# EAGLE board FPGA-Validation (EAGLE 9.4.2), part 1 of 2
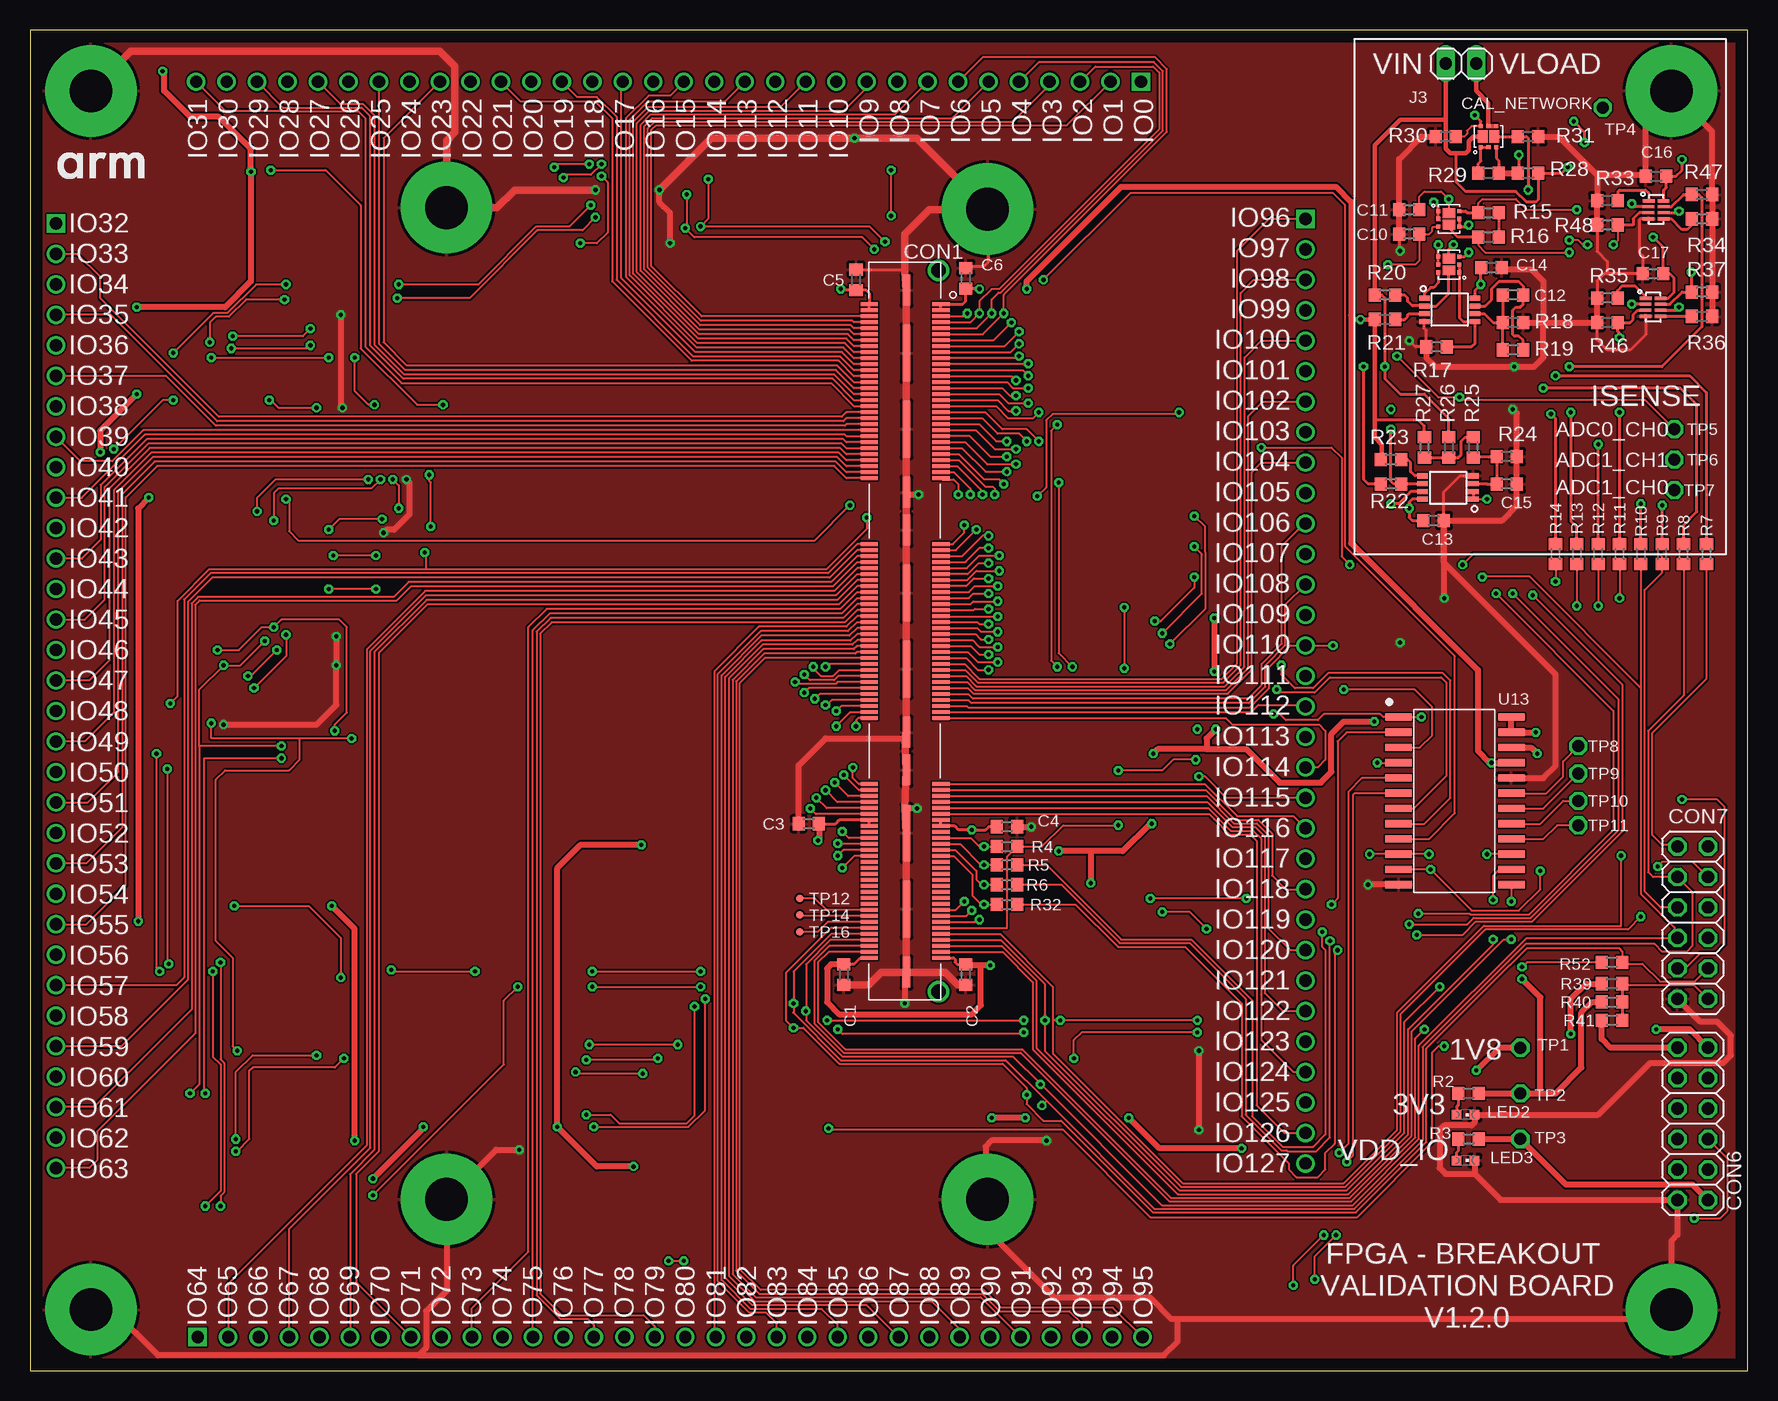
[diagram p7: board, top side]
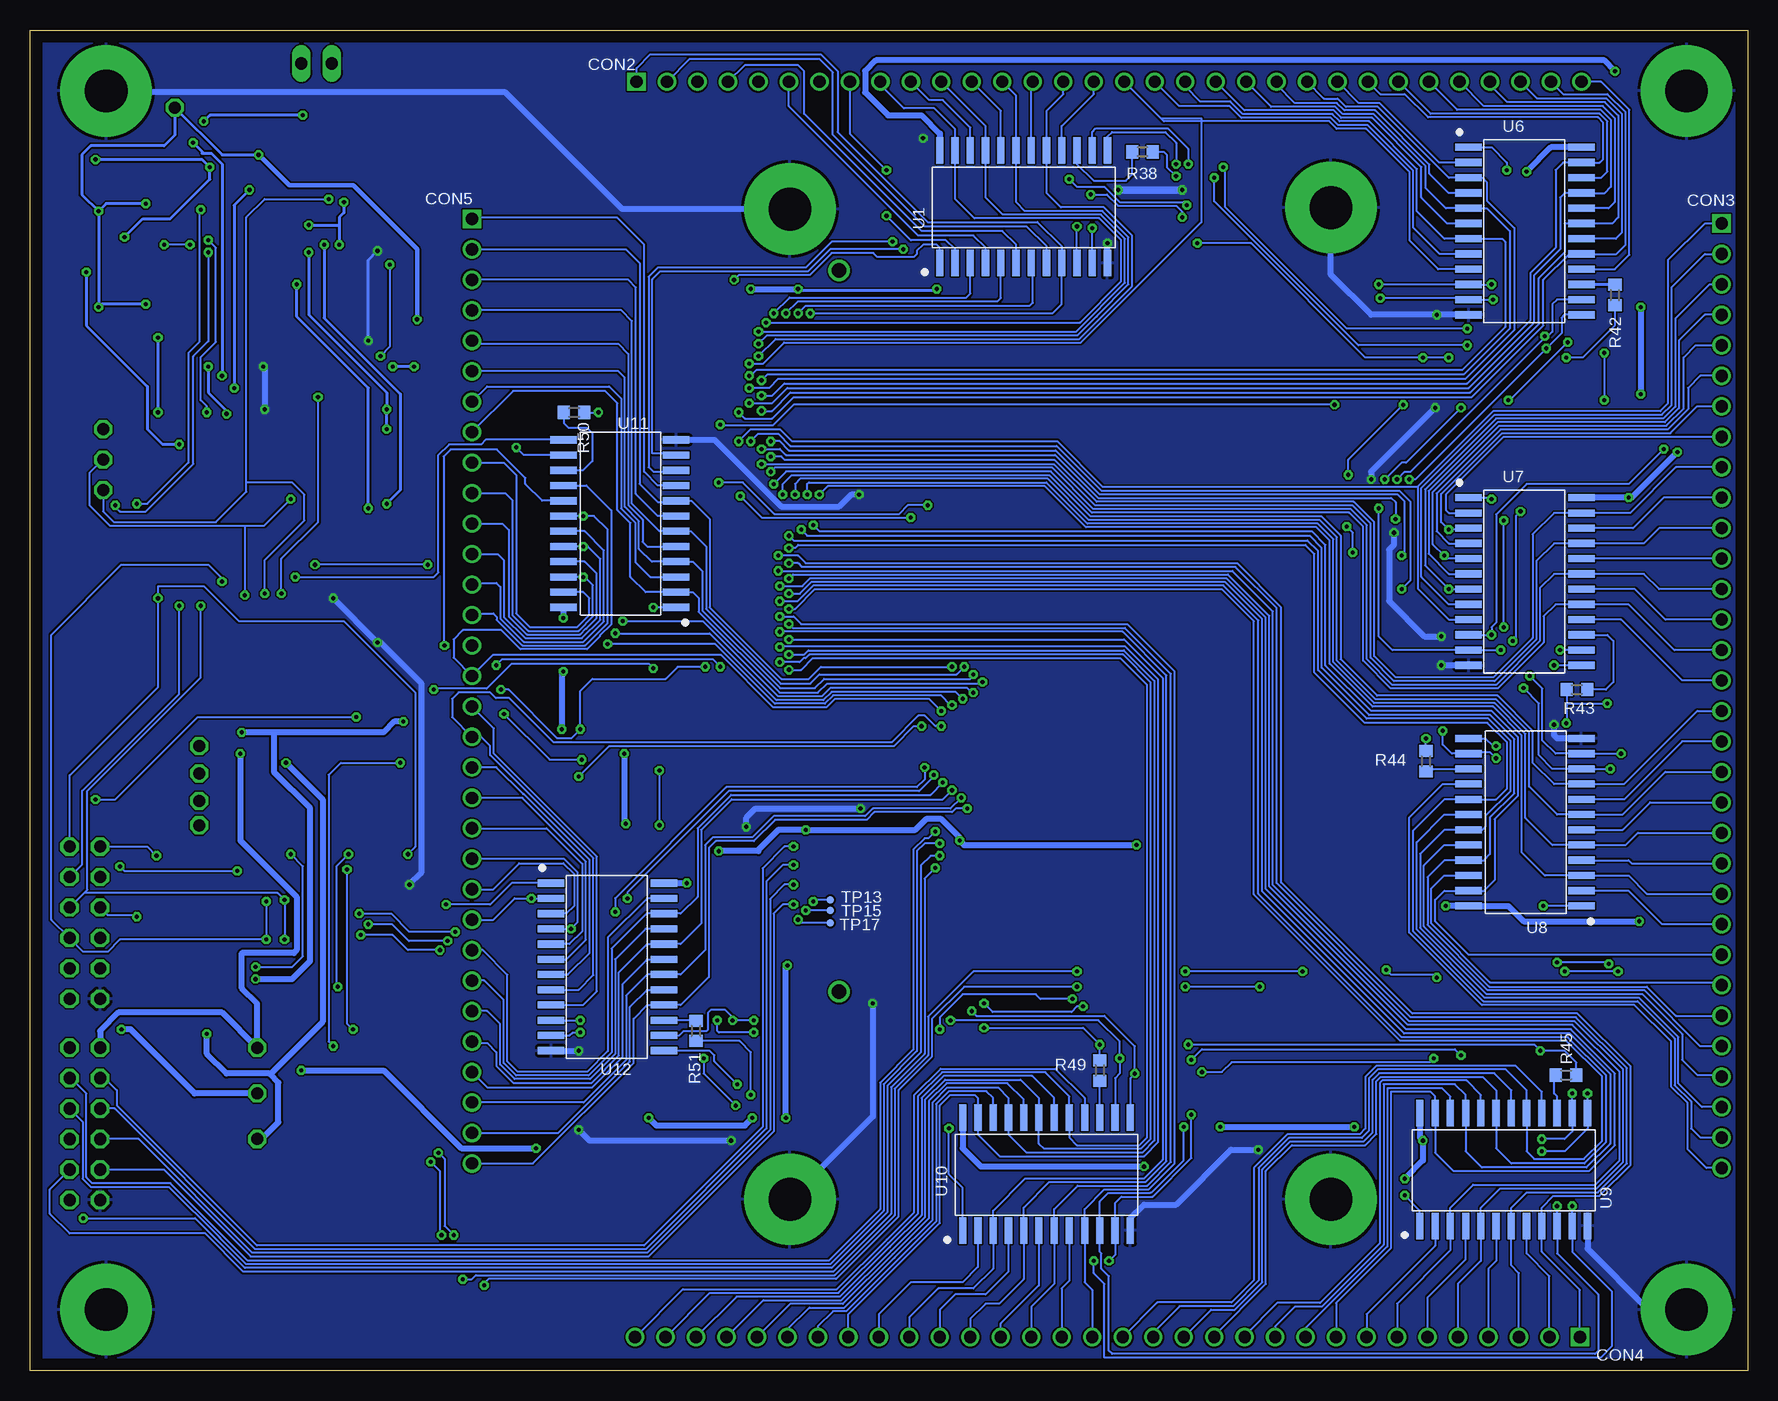
[diagram p8: board, bottom side, seen from below]

Size 143.13 x 111.76 mm. Coordinates in mm from the lower left corner, seen from the top.
Outline: 0,0 143.13,0 143.13,111.76 0,111.76 0,0
Copper layers (1*16): Top 0.035mm / dielectric 1.5mm / Bottom 0.035mm
Design rules "default": minimum track width 6mil, minimum drill 0.35mm, track to track 6mil, track to pad 6mil, pad to pad 6mil, via to via 6mil, smd to smd 6mil, copper to edge 40mil, drill to drill 6mil, minimum pad ring 10mil, minimum via ring 8mil, stop-mask expansion 4mil, vias tented up to drill 0mil, thermal gap 10mil

## Footprints (pad centres in the part's own frame; a part is rotated, then mirrored left to right if it is on the bottom)
0603 = smd 1 x 1.1: 1 -0.85,0; 2 0.85,0
QSH-090-01-L-D-A = smd 0.305 x 1.45: 1 0,-5.969; 2 0,-0.001; 3 0.5,-5.969; 4 0.5,-0.001; 5 1,-5.969; 6 1,-0.001; 7 1.5,-5.969; 8 1.5,-0.001; 9 2,-5.969; 10 2,-0.001; 11 2.5,-5.969; 12 2.5,-0.001; 13 3,-5.969; 14 3,-0.001; 15 3.5,-5.969; 16 3.5,-0.001; 17 4,-5.969; 18 4,-0.001; 19 4.5,-5.969; 20 4.5,-0.001; 21 5,-5.969; 22 5,-0.001; 23 5.5,-5.969; 24 5.5,-0.001; 25 6,-5.969; 26 6,-0.001; 27 6.5,-5.969; 28 6.5,-0.001; 29 7,-5.969; 30 7,-0.001; 31 7.5,-5.969; 32 7.5,-0.001; 33 8,-5.969; 34 8,-0.001; 35 8.5,-5.969; 36 8.5,-0.001; 37 9,-5.969; 38 9,-0.001; 39 9.5,-5.969; 40 9.5,-0.001; 41 10,-5.969; 42 10,-0.001; 43 10.5,-5.969; 44 10.5,-0.001; 45 11,-5.969; 46 11,-0.001; 47 11.5,-5.969; 48 11.5,-0.001; 49 12,-5.969; 50 12,-0.001; 51 12.5,-5.969; 52 12.5,-0.001; 53 13,-5.969; 54 13,-0.001; 55 13.5,-5.969; 56 13.5,-0.001; 57 14,-5.969; 58 14,-0.001; 59 14.5,-5.969; 60 14.5,-0.001; 61 20,-5.969; 62 20,-0.001; 63 20.5,-5.969; 64 20.5,-0.001; 65 21,-5.969; 66 21,-0.001; 67 21.5,-5.969; 68 21.5,-0.001; 69 22,-5.969; 70 22,-0.001; 71 22.5,-5.969; 72 22.5,-0.001; 73 23,-5.969; 74 23,-0.001; 75 23.5,-5.969; 76 23.5,-0.001; 77 24,-5.969; 78 24,-0.001; 79 24.5,-5.969; 80 24.5,-0.001; 81 25,-5.969; 82 25,-0.001; 83 25.5,-5.969; 84 25.5,-0.001; 85 26,-5.969; 86 26,-0.001; 87 26.5,-5.969; 88 26.5,-0.001; 89 27,-5.969; 90 27,-0.001; 91 27.5,-5.969; 92 27.5,-0.001; 93 28,-5.969; 94 28,-0.001; 95 28.5,-5.969; 96 28.5,-0.001; 97 29,-5.969; 98 29,-0.001; 99 29.5,-5.969; 100 29.5,-0.001; 101 30,-5.969; 102 30,-0.001; 103 30.5,-5.969; 104 30.5,-0.001; 105 31,-5.969; 106 31,-0.001; 107 31.5,-5.969; 108 31.5,-0.001; 109 32,-5.969; 110 32,-0.001; 111 32.5,-5.969; 112 32.5,-0.001; 113 33,-5.969; 114 33,-0.001; 115 33.5,-5.969; 116 33.5,-0.001; 117 34,-5.969; 118 34,-0.001; 119 34.5,-5.969; 120 34.5,-0.001; 121 40,-5.969; 122 40,-0.001; 123 40.5,-5.969; 124 40.5,-0.001; 125 41,-5.969; 126 41,-0.001; 127 41.5,-5.969; 128 41.5,-0.001; 129 42,-5.969; 130 42,-0.001; 131 42.5,-5.969; 132 42.5,-0.001; 133 43,-5.969; 134 43,-0.001; 135 43.5,-5.969; 136 43.5,-0.001; 137 44,-5.969; 138 44,-0.001; 139 44.5,-5.969; 140 44.5,-0.001; 141 45,-5.969; 142 45,-0.001; 143 45.5,-5.969; 144 45.5,-0.001; 145 46,-5.969; 146 46,-0.001; 147 46.5,-5.969; 148 46.5,-0.001; 149 47,-5.969; 150 47,-0.001; 151 47.5,-5.969; 152 47.5,-0.001; 153 48,-5.969; 154 48,-0.001; 155 48.5,-5.969; 156 48.5,-0.001; 157 49,-5.969; 158 49,-0.001; 159 49.5,-5.969; 160 49.5,-0.001; 161 50,-5.969; 162 50,-0.001; 163 50.5,-5.969; 164 50.5,-0.001; 165 51,-5.969; 166 51,-0.001; 167 51.5,-5.969; 168 51.5,-0.001; 169 52,-5.969; 170 52,-0.001; 171 52.5,-5.969; 172 52.5,-0.001; 173 53,-5.969; 174 53,-0.001; 175 53.5,-5.969; 176 53.5,-0.001; 177 54,-5.969; 178 54,-0.001; 179 54.5,-5.969; 180 54.5,-0.001 | smd 2.54 x 0.64: P$1 15.7,-2.865; P$4 -1.19,-2.865; P$5 35.7,-2.865; P$8 18.81,-2.865; P$9 55.7,-2.865; P$12 38.81,-2.865 | smd 4.7 x 0.64: P$2 10.429,-2.865; P$3 4.079,-2.865; P$6 30.429,-2.865; P$7 24.079,-2.865; P$10 50.429,-2.865; P$11 44.079,-2.865 | drill 1.19 pad 1.19: P$15 -2.815,-0.195; P$18 57.315,-0.195
1X32 = drill 1.016 square: 1 -24.13,0 | drill 1.016: 2 -21.59,0; 3 -19.05,0; 4 -16.51,0; 5 -13.97,0; 6 -11.43,0; 7 -8.89,0; 8 -6.35,0; 9 -3.81,0; 10 -1.27,0; 11 1.27,0; 12 3.81,0; 13 6.35,0; 14 8.89,0; 15 11.43,0; 16 13.97,0; 17 16.51,0; 18 19.05,0; 19 21.59,0; 20 24.13,0; 21 26.67,0; 22 29.21,0; 23 31.75,0; 24 34.29,0; 25 36.83,0; 26 39.37,0; 27 41.91,0; 28 44.45,0; 29 46.99,0; 30 49.53,0; 31 52.07,0; 32 54.61,0
2X06 = drill 1.016 octagon: 1 -2.54,-1.27; 2 -2.54,1.27; 3 0,-1.27; 4 0,1.27; 5 2.54,-1.27; 6 2.54,1.27; 7 5.08,-1.27; 8 5.08,1.27; 9 7.62,-1.27; 10 7.62,1.27; 11 10.16,-1.27; 12 10.16,1.27
1X02 = drill 1.016 long: 1 -1.27,0; 2 1.27,0
CHIPLED_0603 = smd 0.8 x 0.8: A 0,-0.75; C 0,0.75
PTH-140-300 = drill 3.556 pad 7.62: 1 0,0
SOT1118 = smd 0.35 x 0.35: 1 -0.65,-0.875; 2 0,-0.875; 3 0.65,-0.875; 4 0.65,0.875; 5 0,0.875; 6 -0.65,0.875 | smd 0.82 x 1.05: 7 -0.49,0; 8 0.49,0
0603@1 = smd 1 x 1.1: 1 -0.85,0; 2 0.85,0
TP50-PTH = drill 1 octagon: TP 0,0
TP25-SMD = smd 0.635 x 0.635: TP 0,0
SO24 = smd 0.6 x 2.2: 1 -6.985,-4.7; 2 -5.715,-4.7; 3 -4.445,-4.7; 4 -3.175,-4.7; 5 -1.905,-4.7; 6 -0.635,-4.7; 7 0.635,-4.7; 8 1.905,-4.7; 9 3.175,-4.7; 10 4.445,-4.7; 11 5.715,-4.7; 12 6.985,-4.7; 13 6.985,4.7; 14 5.715,4.7; 15 4.445,4.7; 16 3.175,4.7; 17 1.905,4.7; 18 0.635,4.7; 19 -0.635,4.7; 20 -1.905,4.7; 21 -3.175,4.7; 22 -4.445,4.7; 23 -5.715,4.7; 24 -6.985,4.7
MSOP8 = smd 0.42 x 0.889: 1 0,0; 2 0.65,0; 3 1.3,0; 4 1.95,0; 5 1.95,4.215; 6 1.3,4.215; 7 0.65,4.215; 8 0,4.215
XSON8 = smd 0.3 x 1: 1 -0.75,-0.6 | smd 0.25 x 0.95: 2 -0.25,-0.625; 3 0.25,-0.625; 6 0.25,0.625; 7 -0.25,0.625 | smd 0.3 x 0.95: 4 0.75,-0.625; 5 0.75,0.625; 8 -0.75,0.625

## Placement (x,y rotation side)
C1  100nF  [0603]  67.82,33.02 270 top
C2  100nF  [0603]  77.98,33.02 270 top
C3  100nF  [0603]  64.9,45.59 180 top
C4  100nF  [0603]  81.41,45.34 0 top
C5  100nF  [0603]  68.83,90.93 90 top
C6  100nF  [0603]  77.98,91.06 90 top
C10  100nF  [0603]  114.94,94.74 180 top
C11  100nF  [0603]  114.94,96.77 180 top
C12  380p - DNI  [0603]  123.57,89.66 0 top
C13  100nF  [0603]  116.97,70.87 0 top
C14  100nF  [0603]  121.79,91.95 0 top
C15  10nF  [0603]  123.06,73.91 0 top
C16  100nF  [0603]  135.51,99.57 0 top
C17  100nF  [0603]  135.25,91.44 0 top
CON1  QSH-090-01-L-D-A  [QSH-090-01-L-D-A]  75.9,88.9 270 top
CON2  PINHD-1X32  [1X32]  68.45,107.44 180 top
CON3  PINHD-1X32  [1X32]  2.16,71.5 270 top
CON4  PINHD-1X32  [1X32]  38.1,2.79 0 top
CON5  PINHD-1X32  [1X32]  106.3,71.88 270 top
CON6  PINHD-2X6  [2X06]  138.56,24.38 270 top
CON7  PINHD-2X6  [2X06]  138.56,41.15 270 top
J3  2pinCONN  [1X02]  119.25,108.97 0 top
LED2  GREEN  [CHIPLED_0603]  119.63,21.34 270 top
LED3  GREEN  [CHIPLED_0603]  119.63,17.53 270 top
PTH1  FIXINGHOLE  [PTH-140-300]  79.8,96.83 0 top
PTH2  FIXINGHOLE  [PTH-140-300]  34.71,96.95 0 top
PTH3  FIXINGHOLE  [PTH-140-300]  34.71,14.28 0 top
PTH4  FIXINGHOLE  [PTH-140-300]  79.8,14.28 0 top
PTH5  FIXINGHOLE  [PTH-140-300]  5.08,5.08 0 top
PTH6  FIXINGHOLE  [PTH-140-300]  136.78,5.08 0 top
PTH7  FIXINGHOLE  [PTH-140-300]  5.08,106.68 0 top
PTH8  FIXINGHOLE  [PTH-140-300]  136.78,106.68 0 top
Q2  PMDPB55XP  [SOT1118]  118.24,96.01 270 top
Q3  PMDPB55XP  [SOT1118]  118.24,92.2 90 top
Q4  PMDPB55XP  [SOT1118]  121.54,102.87 0 top
R2  1k  [0603]  119.89,23.11 0 top
R3  1k  [0603]  119.89,19.3 0 top
R4  0R0  [0603]  81.41,43.69 180 top
R5  0R0  [0603]  81.41,42.16 180 top
R6  0R0  [0603]  81.41,40.51 180 top
R7  0R0  [0603]  139.7,68.07 270 top
R8  0R0  [0603]  137.79,68.07 270 top
R9  0R0  [0603]  136.02,68.07 270 top
R10  0R0  [0603]  134.24,68.07 270 top
R11  0R0  [0603]  132.46,68.07 270 top
R12  0R0  [0603]  130.68,68.07 270 top
R13  0R0  [0603]  128.91,68.07 270 top
R14  0R0  [0603]  127.13,68.07 270 top
R15  100k  [0603@1]  121.54,96.52 0 top
R16  100k  [0603@1]  121.54,94.49 0 top
R17  390R 1%  [0603@1]  117.22,85.34 180 top
R18  1K 1%  [0603@1]  123.57,87.38 0 top
R19  2K  [0603@1]  123.57,85.09 180 top
R20  100R  [0603@1]  112.9,89.66 180 top
R21  100R  [0603@1]  112.9,87.63 180 top
R22  100R  [0603@1]  113.41,73.91 180 top
R23  100R  [0603@1]  113.41,75.95 180 top
R24  100R  [0603@1]  123.06,76.2 0 top
R25  330R  [0603@1]  120.27,76.96 270 top
R26  0R0 DNI  [0603@1]  118.24,76.96 270 top
R27  0R0  [0603@1]  116.2,76.96 270 top
R28  1K 1%  [0603@1]  124.84,99.82 0 top
R29  4R7  [0603@1]  121.54,99.82 180 top
R30  10k  [0603@1]  117.98,102.87 0 top
R31  10k  [0603@1]  124.84,102.87 180 top
R32  0R0  [0603]  81.41,38.86 180 top
R33  130K 1%  [0603@1]  131.44,97.54 180 top
R34  13.7K 1%  [0603@1]  139.32,96.01 0 top
R35  649R 1%  [0603@1]  131.44,89.41 180 top
R36  68R1 1%  [0603@1]  139.32,87.88 0 top
R37  100k  [0603@1]  139.32,89.92 180 top
R38  100k  [0603]  50.42,101.6 180 bottom
R39  NF  [0603]  131.83,32.26 0 top
R40  NF  [0603]  131.83,30.73 0 top
R41  0R0  [0603]  131.83,29.21 0 top
R42  100k  [0603]  11.05,89.66 90 bottom
R43  100k  [0603]  14.22,56.77 0 bottom
R44  100k  [0603]  26.8,50.8 270 bottom
R45  100k  [0603]  15.11,24.64 180 bottom
R46  100k  [0603@1]  131.44,87.38 0 top
R47  100k  [0603@1]  139.32,98.04 180 top
R48  100k  [0603@1]  131.44,95.5 0 top
R49  100k  [0603]  53.98,25.02 270 bottom
R50  100k  [0603]  97.79,79.88 180 bottom
R51  100k  [0603]  87.63,28.32 90 bottom
R52  100k  [0603]  131.83,34.04 180 top
TP1  TEST_POINT-50R-PTH  [TP50-PTH]  124.21,26.92 270 top
TP2  TEST_POINT-50R-PTH  [TP50-PTH]  124.21,23.11 0 top
TP3  TEST_POINT-50R-PTH  [TP50-PTH]  124.21,19.3 270 top
TP4  TEST-POINT-50R-PTH  [TP50-PTH]  131.06,105.28 0 top
TP5  TEST-POINT-50R-PTH  [TP50-PTH]  137.03,78.49 0 top
TP6  TEST-POINT-50R-PTH  [TP50-PTH]  137.03,75.95 180 top
TP7  TEST-POINT-50R-PTH  [TP50-PTH]  137.03,73.41 0 top
TP8  TEST_POINT-50R-PTH  [TP50-PTH]  129.03,52.07 0 top
TP9  TEST_POINT-50R-PTH  [TP50-PTH]  129.03,49.78 0 top
TP10  TEST_POINT-50R-PTH  [TP50-PTH]  129.03,47.5 0 top
TP11  TEST_POINT-50R-PTH  [TP50-PTH]  129.03,45.47 0 top
TP12  TEST_POINT-25R-SMD  [TP25-SMD]  64.14,39.37 0 top
TP13  TEST_POINT-25R-SMD  [TP25-SMD]  76.45,39.24 0 bottom
TP14  TEST_POINT-25R-SMD  [TP25-SMD]  64.14,37.97 0 top
TP15  TEST_POINT-25R-SMD  [TP25-SMD]  76.45,38.35 0 bottom
TP16  TEST_POINT-25R-SMD  [TP25-SMD]  64.14,36.58 0 top
TP17  TEST_POINT-25R-SMD  [TP25-SMD]  76.45,37.34 0 bottom
U1  CD74HCT4067  [SO24]  60.33,97.03 0 bottom
U2  LTC2051IMS8  [MSOP8]  120.27,72.64 90 top
U3  LTC2051IMS8  [MSOP8]  116.2,89.41 270 top
U4  NX3L2T66  [XSON8]  135.51,96.77 270 top
U5  NX3L2T66  [XSON8]  135.25,88.65 270 top
U6  CD74HCT4067  [SO24]  18.54,95 270 bottom
U7  CD74HCT4067  [SO24]  18.54,65.79 270 bottom
U8  CD74HCT4067  [SO24]  18.54,45.72 90 bottom
U9  CD74HCT4067  [SO24]  20.32,16.76 0 bottom
U10  CD74HCT4067  [SO24]  58.42,16.38 0 bottom
U11  CD74HCT4067  [SO24]  93.98,70.61 90 bottom
U12  CD74HCT4067  [SO24]  95,33.66 270 bottom
U13  CD74HCT4067  [SO24]  118.75,47.5 270 top

## Tracks (layer width: path | path; a pad name or v marks a point on that pad's centre or on a via)
+1.8V  (via drill 0.35)
  Top 0.254: C1.1 67.86,33.91 68.71,33.91 69.2,34.4 CON1.179 | CON1.180 76.94,34.4 76.96,34.42 77.09,34.29 77.09,34.04 77.25,33.87 C2.1
  Top 0.508: CON6.1 131.7,26.92 130.98,27.65 R41.1 | TP1.TP 122.43,26.92 v120.52,25.02 | v100.97,18.54 94.11,18.54 v91.57,21.08 | v82.93,21.08 v80.14,21.08 | v80.01,33.78 79.25,33.78 | 79.25,33.78 78.07,33.78 C2.1 | C1.1 66.76,33.87 66.42,33.53 66.42,30.73 67.44,29.72 78.49,29.72 79.25,30.48 79.25,33.78 | U13.22 125.09,51.94 v125.6,51.44
  Bottom 0.508: CON6.1 137.29,28.32 135.76,29.84 127.13,29.84 TP1.TP 124.21,30.61 125.48,31.88 125.48,34.82 121.14,34.82 120.9,35.05 120.9,39.5 125.6,44.2 v125.6,51.44 | v120.52,25.02 113.67,25.02 107.19,18.54 v100.97,18.54 | v91.57,21.08 90.93,20.45 83.57,20.45 v82.93,21.08 | v80.14,21.08 80.14,33.66 v80.01,33.78
+3.3V  (via drill 0.35)
  Top 0.254: CON1.135 CON1.133 67.45,45.9 67.14,45.59 C3.1 | C4.1 79.88,45.34 79.63,45.09 v78.49,45.09 77.36,45.09 77.05,45.4 CON1.136 CON1.134
  Top 0.508: 125.86,23.11 TP2.TP R2.2 | 125.86,23.11 127.13,23.11 129.29,25.27 129.29,29.84 130.18,30.73 R40.1 | CON6.2 138.3,28.45 v135.51,28.45 | v8.89,88.65 16.26,88.65 18.41,90.81 v18.41,99.95 18.41,101.85 15.75,104.52 13.34,104.52 11.18,106.68 11.18,108.2 v11.05,108.33 | v8.89,81.41 5.84,78.36 v5.84,76.58 | v9.02,37.47 9.02,71.88 v9.91,72.77 | v27.05,19.18 27.05,36.83 v25.15,38.73 | v50.29,17.02 47.24,17.02 v43.94,20.32 43.94,41.91 45.85,43.81 v50.93,43.81 | v32.77,20.32 32.77,20.19 v28.57,16 | C3.1 65.79,45.55 65.79,44.32 v65.66,44.2 | v98.68,62.74 v98.68,58.29 | 88.39,43.31 v88.39,40.64 | 88.39,43.31 v85.72,43.31 | v93.47,45.59 93.34,45.59 91.06,43.31 88.39,43.31 | 98.04,51.82 93.98,51.82 v93.6,51.44 | v98.81,53.47 98.04,52.7 98.04,51.82 | U13.24 U13.23 v125.48,53.21 | 98.04,51.82 101.35,51.82 104.14,49.02 107.57,49.02 108.46,49.91 108.46,53.09 109.47,54.1 v112.01,54.1 | 125.86,23.11 125.86,31.11 v124.33,32.64
  Bottom 0.508: TP2.TP 129.41,23.11 134.75,28.45 v135.51,28.45 | U6.24 16.38,101.98 v18.41,99.95 | v8.89,88.65 v8.89,81.41 | v5.84,76.58 9.65,72.77 v9.91,72.77 U7.24 | v9.02,37.47 18.67,37.47 19.94,38.73 U8.24 v25.15,38.73 | U9.24 27.3,19.43 v27.05,19.18 27.05,17.53 v28.57,16 | U10.24 65.41,18.54 63.88,17.02 v50.29,17.02 | v43.94,20.32 v32.77,20.32 | v50.93,43.81 65.28,43.81 v65.66,44.2 65.66,44.45 67.18,45.97 68.45,45.97 69.34,45.09 v78.49,45.09 80.77,45.09 82.49,43.37 82.42,43.31 v85.72,43.31 | U11.24 v98.68,62.74 | U12.24 v88.39,40.64 | v93.6,51.44 93.6,45.72 v93.47,45.59 | v98.68,58.29 98.81,58.17 v98.81,53.47 | v112.01,54.1 112.78,54.1 113.67,53.21 v125.48,53.21 122.81,53.21 122.81,49.91 119.79,46.89 119.79,34.14 121.28,32.64 v124.33,32.64 | v11.05,108.33 11.94,109.22 72.64,109.22 73.53,108.33 73.53,106.55 71.63,104.65 68.83,104.65 67.31,103.12 U1.24
+3.3V_IF
  Top 0.254: R15.2 R16.2
ADC0_CH0  (via drill 0.35)
  Top 0.152: Q2.3 116.95,95.36 116.84,95.25 116.84,95 116.59,94.74 C10.1 115.78,92.54 115.44,92.2 v113.16,92.2 | v113.92,84.58 117.35,81.15 v119.13,81.15 119.38,80.9 134.62,80.9 TP5.TP | R5.1 84.71,42.16 90.93,35.94 96.77,35.94 101.85,30.86 101.85,21.21 104.39,18.67 106.93,18.67 107.95,19.68 107.95,35.05 107.7,35.31 v107.7,36.58 | v115.7,38.1 119.97,38.1 120.02,38.05 124.92,38.05 131.95,45.09 131.95,54.99 v122.17,64.77
  Bottom 0.152: v113.16,92.2 113.16,85.34 v113.92,84.58 | v107.7,36.58 111.51,36.58 113.03,38.1 v115.7,38.1 | v122.17,64.77 122.17,67.69 119.13,70.74 v119.13,81.15
ADC0_CH1
  Top 0.254: U3.7 121.27,88.76 121.79,89.28 121.79,90.18 122.42,90.81 124.04,90.81 124.42,90.42 C12.2 124.42,88.86 124.21,88.65 123.83,88.65 123.57,88.39 123.57,86.36 123.7,86.23 124.08,86.23 124.42,85.89 R19.1
ADC1_CH0  (via drill 0.35)
  Top 0.152: C11.1 115.78,97.88 116.2,98.3 117.6,98.3 v118.24,97.66 Q2.7 | R6.1 85.93,40.51 90.81,35.64 96.65,35.64 101.3,30.99 101.3,21.34 104.27,18.36 104.7,18.36 104.78,18.29 107.19,18.29 108.33,19.43 v108.33,35.81 | v114.94,37.21 119.76,37.21 120.29,37.74 125.04,37.74 132.33,45.03 132.33,56.01 v123.57,64.77
  Bottom 0.152: TP7.TP 137.03,71.63 136.14,70.74 127.64,70.74 125.09,73.28 125.09,74.04 | 125.09,74.04 125.09,96.14 123.57,97.66 v118.24,97.66 | v108.33,35.81 111.56,35.81 112.95,37.21 v114.94,37.21 | v123.57,64.77 123.57,67.56 120.27,70.87 120.27,73.03 121.28,74.04 125.09,74.04
ADC1_CH1  (via drill 0.35)
  Top 0.152: U2.1 v121.41,72.64 | R32.1 87.12,38.86 90.68,35.31 96.27,35.31 100.97,30.61 100.97,21.21 104.9,17.27 104.9,16.76 105.54,16.13 107.31,16.13 107.95,16.76 107.95,18.16 108.71,18.92 108.71,34.8 v108.97,35.05 | v115.57,36.32 119.38,36.32 120.5,37.44 125.17,37.44 132.72,44.98 132.72,57.15 v125.22,64.64
  Top 0.254: U2.2 U2.1
  Bottom 0.152: TP6.TP 138.18,74.8 138.18,72.14 136.47,70.43 125.22,70.43 | 125.22,70.43 123.62,70.43 v121.41,72.64 | v108.97,35.05 111.63,35.05 112.9,36.32 v115.57,36.32 | 125.22,70.43 v125.22,64.64
ADIG_SP1
  Top 0.152: CON1.163 66.38,38.4 65.41,39.37 TP12.TP
ADIG_SP2  (via drill 0.35)
  Top 0.152: CON1.164 77.14,38.4 v77.85,39.12
  Bottom 0.152: TP13.TP 77.72,39.24 v77.85,39.12
ADIG_SP3
  Top 0.152: CON1.165 64.21,37.9 TP14.TP
ADIG_SP4  (via drill 0.35)
  Top 0.152: CON1.166 78.03,37.9 v78.49,38.35
  Bottom 0.152: TP15.TP v78.49,38.35
ADIG_SP5
  Top 0.152: CON1.167 66.48,37.4 65.66,36.58 TP16.TP
ADIG_SP6  (via drill 0.35)
  Top 0.152: CON1.168 78.93,37.4 v79.12,37.59
  Bottom 0.152: TP17.TP 78.87,37.34 v79.12,37.59
AN_AD0  (via drill 0.35)
  Top 0.152: CON1.172 80.84,36.4 85.24,32 85.24,29.21 | 85.24,29.21 85.24,26.44 96.06,15.62 109.47,15.62 113.92,20.07 113.92,29.84 121.16,37.08 132.59,37.08 v132.59,42.93 | CON7.1 137.16,43.81 136.02,43.81 135.15,44.68 135.15,53.11 139.7,57.66 R7.2 | v56.52,99.31 56.52,96.01 v55.88,95.38 69.98,95.38 v71.25,94.11 | v46.74,97.16 44.96,95.38 42.16,95.38 37.34,90.55 v30.73,90.55 | v18.67,56.9 21.34,59.56 v21.34,61.34 | v21.34,90.55 18.84,90.55 16.46,88.16 15.27,88.16 v11.94,84.84 | v11.94,80.9 11.05,80.9 v6.99,76.83 | v11.43,50.16 11.43,34.04 v11.56,33.91 | v15.88,34.04 15.88,25.96 16.18,25.65 16.18,14.86 15.88,14.55 v15.88,13.72 | v46.99,20.32 54.86,20.32 56.26,21.72 v56.26,30.99 | v97.28,29.21 v85.85,29.21 85.24,29.21 | v82.8,28.19 82.68,28.07 67.69,28.07 v67.31,28.45
  Bottom 0.152: CON7.1 133.35,43.69 v132.59,42.93 | U1.10 v55.88,95.38 | v56.52,99.31 55.88,98.68 53.59,98.68 52.32,97.41 46.99,97.41 v46.74,97.16 | v30.73,90.55 U6.10 v21.34,90.55 | v18.67,56.9 17.4,55.63 17.4,51.31 16.26,50.16 U8.10 v11.43,50.16 | U7.10 v21.34,61.34 21.34,61.98 20.95,62.36 20.95,71.37 18.41,73.91 9.91,73.91 v6.99,76.83 | v11.94,84.84 v11.94,80.9 | v11.56,33.91 11.68,34.04 v15.88,34.04 | v15.88,13.72 U9.10 15.88,9.78 12.45,6.35 12.45,1.65 12.7,1.4 52.96,1.4 53.21,1.65 53.21,7.87 53.85,8.51 53.85,9.78 53.98,9.9 U10.10 53.98,14.1 53.26,14.81 49.78,14.81 49.73,14.86 49.66,14.86 46.99,17.53 v46.99,20.32 | v71.25,94.11 76.33,94.11 78.49,91.95 90.81,91.95 91.57,91.19 91.57,75.31 91.19,74.93 89.41,74.93 U11.10 | v56.26,30.99 58.93,30.99 59.31,31.37 65.41,31.37 67.31,29.46 v67.31,28.45 | U12.10 v97.28,29.21 | v85.85,29.21 85.85,28.32 85.72,28.19 v82.8,28.19
AN_AD1  (via drill 0.35)
  Top 0.152: CON1.171 66.75,36.4 63.63,33.27 v63.63,30.61 63.63,29.87 63.6,29.85 67.57,25.88 81.31,25.88 84.71,22.48 | R8.2 137.79,56.29 134.85,53.34 134.85,41.55 135.25,41.15 CON7.3 138.56,39.88 138.56,35.43 138.05,34.92 136.02,34.92 135.38,35.56 124.64,35.56 116.05,26.98 116.05,19.18 110.36,13.49 93.7,13.49 84.71,22.48 | v54.74,98.04 54.74,95.38 v54.61,95.25 55.37,94.49 69.34,94.49 v70.36,93.47 | v47.12,96.14 46.05,95.07 42.29,95.07 36.63,89.41 v30.61,89.41 | v20.57,60.07 18.41,57.91 v18.16,57.91 | v21.21,89.28 18,89.28 16.58,87.86 15.49,87.86 14.99,87.35 v14.99,85.72 | v19.94,80.9 20.07,80.9 20.7,80.26 v23.88,80.26 | v30.23,74.3 30.73,73.79 v30.73,71.88 | v53.21,9.14 v54.48,9.14 | v10.54,51.44 10.54,33.53 v10.79,33.27 | v15.24,33.27 15.24,26.16 15.88,25.53 15.88,14.99 v14.61,13.72 | v46.35,21.34 48.39,21.34 49.1,20.62 54.74,20.62 55.35,21.23 55.35,30.33 v55.37,30.35 | v97.28,28.19 87.63,28.19 87,27.56 v87,26.04 | v84.33,22.1 84.71,22.48
  Bottom 0.152: U1.11 v54.61,95.25 | v54.74,98.04 53.39,98.04 52.45,97.1 47.62,97.1 47.12,96.6 v47.12,96.14 | v30.61,89.41 23.37,89.41 U6.11 v21.21,89.28 | v18.16,57.91 17.09,56.84 17.09,52.53 16,51.44 U8.11 v10.54,51.44 | v20.57,60.07 U7.11 29.59,60.07 30.73,61.21 v30.73,71.88 | v14.99,85.72 19.81,80.9 v19.94,80.9 | v30.23,74.3 28.83,75.69 28.45,75.69 v23.88,80.26 | v54.48,9.14 54.48,8.13 53.59,7.24 53.59,1.09 12.24,1.09 11.3,2.03 11.3,6.6 14.61,9.91 U9.11 v14.61,13.72 | v53.21,9.14 52.7,9.65 U10.11 52.7,13.97 52.17,14.5 49.58,14.5 46.35,17.73 v46.35,21.34 | v10.79,33.27 v15.24,33.27 | U11.11 89.41,76.45 91.26,76.45 91.26,90.98 90.6,91.64 78.28,91.64 76.45,93.47 v70.36,93.47 | v55.37,30.35 55.88,30.35 56.34,29.9 62.92,29.9 v63.63,30.61 | U12.11 98.17,27.94 97.92,28.19 v97.28,28.19 | v87,26.04 87,24.77 v84.33,22.1
AN_AD2  (via drill 0.35)
  Top 0.152: CON1.174 80.91,35.9 84.56,32.26 84.56,29.23 v84.58,29.21 84.58,26.67 95.94,15.32 109.6,15.32 114.22,19.94 114.22,29.72 121.28,36.78 133.17,36.78 v134.24,37.85 | CON7.5 135.89,38.61 134.54,39.95 134.54,65.08 136.02,66.55 R9.2 136.02,67.82 135.76,68.07 120.27,68.07 v119.38,67.18 | v46.61,100.58 43.94,100.58 v43.69,100.33 | v16.89,86.23 22.73,86.23 v23.37,86.87 | v14.61,23.11 14.53,23.19 14.53,51.05 v20.95,51.05 | v29.21,74.3 28.45,73.53 20.7,73.53 20.32,73.15 v20.32,70.87 | v15.62,60.07 17.4,60.07 19.3,61.98 v20.32,61.98 20.95,62.61 25.78,62.61 26.42,61.98 26.42,54.86 25.4,53.85 v25.4,53.34 | v17.14,19.3 17.14,24.89 18.54,26.29 v23.88,26.29 | v52.32,26.04 52.2,25.91 v46.35,25.91 | v66.42,29.21 v82.8,29.21 | v102.62,76.96 108.46,76.96 109.3,76.12 109.3,67.87 v109.98,67.18
  Bottom 0.152: v134.24,37.85 134.37,37.97 136.65,37.97 CON7.5 | U1.14 54.61,103.25 54.3,103.56 48.31,103.56 46.61,101.85 v46.61,100.58 | v43.69,100.33 43.56,100.2 43.56,97.03 33.4,86.87 v23.37,86.87 | U6.14 15.88,89.28 16.26,88.9 16.26,86.61 16.64,86.23 v16.89,86.23 16.89,86.11 28.07,74.93 28.57,74.93 v29.21,74.3 | v14.61,23.11 U9.14 14.61,19.94 15.24,19.3 v17.14,19.3 | v20.95,51.05 v20.96,51.05 21.46,51.56 23.11,51.56 U8.14 24.64,51.44 25.4,52.2 v25.4,53.34 | U7.14 v15.62,60.07 | v20.32,61.98 v20.32,70.87 | v23.88,26.29 24.38,26.8 45.47,26.8 v46.35,25.91 | U10.14 52.7,24.38 52.32,24.77 v52.32,26.04 52.32,27.43 54.1,29.21 v66.42,29.21 | v82.8,29.21 v84.58,29.21 84.58,29.46 85.22,30.1 86.36,30.1 86.61,29.84 86.61,28.45 86.74,28.32 88.65,28.32 89.03,27.94 U12.14 | v109.98,67.18 v119.38,67.18 | U11.14 101.98,76.33 v102.62,76.96
AN_AD3  (via drill 0.35)
  Top 0.152: CON1.173 66.69,35.91 64.67,33.88 64.67,30 v64.64,29.97 64.67,29.95 64.67,29.21 67.69,26.19 81.92,26.19 84.21,23.89 | R10.2 134.24,56.92 | 134.24,56.92 134.24,39.75 137.03,36.96 137.03,36.32 CON7.7 124.71,36.07 115.75,27.1 115.75,19.31 110.23,13.79 94.31,13.79 84.21,23.89 | v47.62,100.58 46.74,99.69 44.7,99.69 v44.45,99.44 | v23.37,85.47 23.11,85.22 v16.76,85.22 | v20.95,52.07 14.1,52.07 | 14.1,52.07 14.1,23.88 v13.34,23.11 | v28.19,74.3 20.45,74.3 18.92,72.77 v18.92,71.63 | v19.56,60.83 17.53,58.8 v16.13,58.8 14.1,56.77 14.1,52.07 | v17.14,18.29 17.27,18.29 18.29,19.3 18.29,25.02 18.54,25.27 25.4,25.27 v26.16,26.04 | v45.47,24.89 45.59,24.77 v51.05,24.77 | 84.21,23.89 v84.2,23.88 | v121.03,66.17 121.06,66.19 124.97,66.19 134.24,56.92
  Bottom 0.152: U1.13 53.34,102.87 52.96,103.25 48.51,103.25 47.62,102.36 v47.62,100.58 | v44.45,99.44 44.45,97.49 32.44,85.47 v23.37,85.47 | U6.13 15.24,88.01 15.49,87.76 15.49,86.49 v16.76,85.22 27.69,74.3 v28.19,74.3 | v13.34,23.11 U9.13 13.34,20.19 15.24,18.29 v17.14,18.29 | U8.13 21.84,52.7 21.21,52.07 v20.95,52.07 | U7.13 v16.13,58.8 | v19.56,60.83 19.3,61.09 19.3,71.25 v18.92,71.63 | v26.16,26.04 26.49,25.7 43,25.7 43.81,24.89 v45.47,24.89 | U10.13 51.44,24.38 v51.05,24.77 51.05,27.05 53.59,29.59 64.26,29.59 v64.64,29.97 | v84.2,23.88 86.11,25.78 86.11,26.29 86.49,26.67 U12.13 | v121.03,66.17 109.47,66.17 109.09,66.55 109.09,76.33 108.2,77.22 105.54,77.22 105.16,77.6 U11.13
AN_AD4  (via drill 0.35)
  Top 0.152: CON1.176 80.98,35.4 83.87,32.51 83.87,26.92 95.78,15.01 109.73,15.01 114.53,19.81 114.53,29.06 v117.47,32 | R11.2 v132.46,64.39 | v116.59,43.05 U13.10 v111.63,43.05
  Bottom 0.152: CON7.2 139.83,49.63 132.46,57 v132.46,64.39 132.46,65.41 128.65,65.41 125.73,62.48 116.97,62.48 111.03,56.54 111.03,43.66 v111.63,43.05 | v116.59,43.05 117.6,42.04 117.6,32.13 v117.47,32
AN_AD5  (via drill 0.35)
  Top 0.152: CON1.175 66.61,35.4 65.35,34.14 65.35,28.96 67.82,26.49 82.55,26.49 94.94,14.1 110.11,14.1 115.44,19.43 115.44,27.69 v116.2,28.45 | R12.2 v130.68,63.75 | U13.11 v116.71,41.78 120.14,38.35 124.08,38.35 125.86,40.13 v125.86,41.66 | CON7.4 138.56,42.42 136.02,42.42 v135.64,42.04
  Bottom 0.152: CON7.4 138.79,42.19 138.79,48.34 130.71,56.41 130.71,63.73 v130.68,63.75 | v116.71,41.78 116.71,28.96 v116.2,28.45 | v135.64,42.04 135.25,41.66 v125.86,41.66
AN_AD6  (via drill 0.35)
  Top 0.152: CON1.178 81.05,34.9 83.57,32.38 83.57,26.8 95.66,14.71 109.85,14.71 114.83,19.69 114.83,28.45 121.92,35.53 v121.92,35.94 | R13.2 v128.91,63.75 | v121.92,39.24 121.92,41.27 122.43,41.78 U13.14
  Bottom 0.152: CON7.6 138.62,39.81 | 138.62,39.81 138.35,40.08 138.35,48.34 128.91,57.78 v128.91,63.75 | v121.92,35.94 v121.92,39.24 122.49,39.81 138.62,39.81
AN_AD7  (via drill 0.35)
  Top 0.152: CON1.177 66.55,34.9 65.66,34.01 65.66,29.08 67.94,26.8 82.68,26.8 95.07,14.4 109.98,14.4 115.14,19.56 115.14,28.27 122.81,35.94 v123.44,35.94 | R14.2 v127.13,65.79 | U13.13 v123.44,39.12
  Bottom 0.152: v127.13,65.79 127.13,66.04 128.27,67.18 135.51,67.18 141.35,61.34 141.35,37.59 CON7.8 138.68,34.92 136.65,34.92 135.64,35.94 v123.44,35.94 v123.44,39.12
ANIN0  (via drill 0.35)
  Top 0.152: CON1.140 78.41,44.4 79.12,43.69 v79.5,43.69 R4.2
  Bottom 0.152: v79.5,43.69 80.26,43.69 82.07,41.88 82.07,20.32 91.95,10.44 124.23,10.44 135.89,22.1 135.89,23.37 136.91,24.38 CON6.3
ANIN1  (via drill 0.35)
  Top 0.152: CON1.139 68.25,44.4 v67.69,44.96
  Bottom 0.152: v67.69,44.96 68.28,44.37 68.58,44.37 69.52,43.43 69.52,26.77 72.29,24 72.29,13.46 76.58,9.17 124.97,9.17 131.42,15.62 137.92,15.62 138.43,16.13 138.43,23.11 139.7,24.38 CON6.4
ANIN4  (via drill 0.35)
  Top 0.152: CON1.142 77.51,43.9 79.25,42.16 v79.5,42.16 R5.2
  Bottom 0.152: v79.5,42.16 80.39,42.16 81.76,40.79 81.76,20.19 91.82,10.13 124.36,10.13 136.07,21.84 CON6.5
ANIN5  (via drill 0.35)
  Top 0.152: CON1.141 67.35,43.9 v67.31,43.94
  Bottom 0.152: v67.31,43.94 68.58,43.94 69.22,43.31 69.22,26.64 71.98,23.88 71.98,13.33 76.45,8.87 125.1,8.87 127.27,11.04 127.33,11.1 131.55,15.32 138.05,15.32 138.74,16 138.74,20.75 CON6.6
ANIN6  (via drill 0.35)
  Top 0.152: R6.2 v79.5,40.51 79.29,40.51 78.87,40.93 78.87,41.66 77.12,43.4 CON1.144
  Bottom 0.152: v79.5,40.51 80.26,40.51 81.46,39.32 81.46,20.07 91.69,9.83 124.61,9.83 134.09,19.3 CON6.7
ANIN7  (via drill 0.35)
  Top 0.152: CON1.143 67.78,43.4 v67.31,42.93 | v138.68,12.7 140.84,12.7 141.48,13.34 141.48,17.65 CON6.8
  Bottom 0.152: v67.31,42.93 68.07,42.93 68.89,42.11 68.89,26.54 71.68,23.75 71.68,13.21 76.33,8.56 125.22,8.56 129.36,12.7 v138.68,12.7
ANIN8  (via drill 0.35)
  Top 0.152: CON1.146 76.99,42.9 78.53,41.36 78.53,39.62 79.29,38.86 v79.5,38.86 R32.2
  Bottom 0.152: v79.5,38.86 80.39,38.86 81.15,38.1 81.15,19.94 91.57,9.53 124.74,9.53 131.98,16.76 CON6.9
ANIN9  (via drill 0.35)
  Top 0.152: CON1.145 68.68,42.9 v67.69,41.91
  Bottom 0.152: v67.69,41.91 68.58,41.02 68.58,26.42 71.37,23.62 71.37,13.08 76.2,8.26 125.35,8.26 128.52,11.43 139.83,11.43 141.48,13.08 141.48,15.11 CON6.10
ANMUX_1  (via drill 0.35)
  Top 0.152: U13.9 116.59,44.32 118.75,46.48 118.75,59.56 109.6,68.71 109.6,97.16 108.58,98.17 91.69,98.17 v84.45,90.93
  Bottom 0.152: U1.1 67.31,93.6 67.56,93.85 68.71,93.85 69.22,93.34 69.22,93.09 69.47,92.84 72.52,92.84 72.85,93.17 76.33,93.17 78.16,91.34 84.05,91.34 v84.45,90.93
ANMUX_2  (via drill 0.35)
  Top 0.152: v20.07,100.08 24.64,100.08 27.56,97.16 27.56,85.22 32.26,80.52 v34.42,80.52 | v85.6,58.67 85.09,59.18 85.09,78.36 v85.6,78.87 | v104.27,58.8 104.27,58.04 105.41,56.9 106.93,56.9 108.2,58.17 117.73,58.17 118.36,57.53 118.36,47.75 116.2,45.59 U13.8
  Bottom 0.152: U6.1 21.34,101.98 20.07,100.71 v20.07,100.08 | v34.42,80.52 79.5,80.52 81.23,78.79 85.52,78.79 v85.6,78.87 | v104.27,58.8 103.76,59.31 86.23,59.31 v85.6,58.67
ANMUX_3  (via drill 0.35)
  Top 0.152: v21.34,72.64 21.59,72.39 21.59,69.98 22.35,69.22 65.41,69.22 v68.33,72.14 | U13.7 115.32,46.86 118.06,49.61 118.06,57.33 117.6,57.78 108.33,57.78 107.06,56.52 104.14,56.52 v103.89,56.77 | v85.72,74.04 85.72,59.82 v86.87,58.67
  Bottom 0.152: U7.1 21.46,72.77 v21.34,72.64 | v68.33,72.14 69.98,72.14 70.69,71.42 81.11,71.42 83.72,74.04 v85.72,74.04 | v86.87,58.67 89.15,58.67 90.17,57.66 96.27,57.66 97.28,56.64 v97.28,53.47 98.04,52.7 99.19,52.7 103.25,56.77 v103.89,56.77
ANMUX_4  (via drill 0.35)
  Top 0.152: v17.02,38.73 23.24,38.73 25.91,36.07 v25.91,32.77 | v30.1,33.4 30.1,33.27 v37.08,33.27 | v46.86,33.27 v55.88,33.27 | U13.6 110.36,48.13 110.24,48.01 110.24,17.91 v109.73,17.4 | v108.84,11.3 107.06,9.53 v107.06,7.62
  Bottom 0.152: U8.1 v17.02,38.73 | v25.91,32.77 26.16,33.02 29.72,33.02 v30.1,33.4 | v37.08,33.27 v46.86,33.27 | v55.88,33.27 64.52,33.27 68.28,29.52 68.28,26.29 71.07,23.5 71.07,12.96 76.07,7.95 105.97,7.95 106.3,7.62 v107.06,7.62 | v109.73,17.4 108.97,16.64 108.97,11.43 v108.84,11.3
ANMUX_5  (via drill 0.35)
  Top 0.152: v28.57,14.61 39.5,25.53 39.5,30.86 v40.64,32 | v46.86,32 v55.88,32 | U13.5 111,49.4 109.86,48.26 109.86,18.92 v109.09,18.16 | v105.28,7.11 105.28,8.76 v107.82,11.3
  Bottom 0.152: U9.1 27.3,13.34 v28.57,14.61 | v40.64,32 v46.86,32 | v55.88,32 65.28,32 67.97,29.31 67.97,26.16 70.76,23.37 70.76,12.83 75.95,7.64 104.9,7.64 105.28,7.26 v105.28,7.11 | v109.09,18.16 108.58,17.65 108.58,12.06 v107.82,11.3
ANMUX_6  (via drill 0.35)
  Top 0.152: v66.55,20.19 66.67,20.07 86.11,20.07 93.37,12.8 110.61,12.8 116.86,19.06 116.86,26.54 117.37,27.05 v117.86,27.05 | v112.27,50.67 U13.4
  Bottom 0.152: U10.1 65.41,15.24 66.55,16.38 v66.55,20.19 | v117.86,27.05 118.24,27.43 118.24,49.66 117.22,50.67 v112.27,50.67
ANMUX_7  (via drill 0.35)
  Top 0.152: U13.3 115.82,51.94 116.84,52.96 116.84,55.32 115.39,56.77 v109.47,56.77 | v91.19,63.63 v91.19,58.55
  Bottom 0.152: v109.47,56.77 109.47,56.84 105.08,56.84 103,58.93 91.57,58.93 v91.19,58.55 | U11.1 v91.19,63.63
ANMUX_8  (via drill 0.35)
  Top 0.152: U13.2 109.73,53.21 108.97,52.45 108.97,39.37 v108.46,38.86
  Bottom 0.152: U12.1 103,40.64 104.78,38.86 v108.46,38.86
CAL_EN  (via drill 0.35)
  Top 0.254: Q4.8 R31.2 124.71,102.87 124.84,102.74 v124.84,98.42 | R8.1 137.79,70.48 138.91,71.6 138.91,80.52 137.52,81.92 v126.11,81.92
  Bottom 0.254: v124.84,98.42 126.11,97.16 v126.11,81.92
CAL_NETWORK  (via drill 0.35)
  Top 0.254: Q4.3 122.19,101.08 122.39,100.88 R29.1 | v124.08,101.35 124.08,99.91 R28.1 | v137.41,88.65 v137.4,88.65 137.15,88.4 U5.6 | U5.2 v133.48,88.9 | U4.6 137.29,96.52 v137.41,96.65 | U4.2 133.74,97.02 v133.48,97.28 | R27.1 116.2,78.74 115.7,79.25 112.05,79.25
  Top 0.381: v110.87,87.63 R21.2 112.05,79.25 112.05,77.81 112.65,77.22 112.65,76.03 R23.2
  Top 0.508: R29.1 R28.1
  Bottom 0.254: v124.08,101.35 127.13,101.35 TP4.TP 131.06,103 131.95,102.11 138.05,102.11 138.81,101.35 138.81,98.04 v137.41,96.65 | v133.48,88.9 137.16,88.9 v137.41,88.65 v137.41,96.65 | v133.48,97.28 136.78,97.28 v137.41,96.65
  Bottom 0.381: v124.08,101.35 121.54,98.81 116.2,98.81 110.87,93.47 v110.87,87.63
CNTRL0  (via drill 0.35)
  Top 0.254: U5.3 133.99,88.4 133.6,88.01 133.6,87.63 133.35,87.38 R46.2 132.29,86.65 132.46,86.49 v132.46,86.11 | R11.1 v132.46,79.88
  Bottom 0.254: v132.46,79.88 v132.46,86.11
CNTRL1  (via drill 0.35)
  Top 0.254: U5.7 136.65,88.9 137.67,89.92 R37.2 138.47,91.53 v138.43,91.57 | R12.1 v130.68,77.22
  Bottom 0.254: v138.43,91.57 138.43,87.12 133.35,82.04 133.35,78.49 132.08,77.22 v130.68,77.22
CNTRL2  (via drill 0.35)
  Top 0.152: v128.27,94.23 129.03,94.23 129.41,93.85 v129.79,93.85 | R48.2 132.29,94.19 v131.95,93.85
  Top 0.254: U4.3 134.11,96.52 133.6,96.01 133.6,95.5 R48.2 | v128.4,79.88 128.4,70.83 128.91,70.32 R13.1
  Bottom 0.152: v128.4,79.88 128.4,80.39 128.91,80.9 128.91,84.48 127.64,85.75 127.64,93.6 v128.27,94.23 | v129.79,93.85 v131.95,93.85
CNTRL3  (via drill 0.35)
  Top 0.254: U4.7 136.78,97.02 137.79,98.04 R47.2 139.06,98.04 139.32,97.79 139.32,87.02 135.99,83.69 v128.27,83.69 | R14.1 127.13,79.38 v126.75,79.76
  Bottom 0.254: v128.27,83.69 128.27,81.53 126.75,80.01 v126.75,79.76
DUT_AN  (via drill 0.35)
  Top 0.152: CON1.170 81.41,36.9 81.41,42.84 R4.1 84.33,43.69 86.11,45.47 v90.68,45.47 | CON7.9 137.92,33.53 139.19,34.8 140.46,34.8 141.22,35.56 141.22,46.99 140.59,47.62 v137.67,47.62 | v115.95,54.48 U13.1 112.78,54.48 112.52,54.74 107.82,54.74 107.31,54.23 104.65,54.23 104.14,54.74 v103.63,54.74 | v97.16,50.93 95.25,50.93 94.36,50.04 v90.68,50.04
  Bottom 0.152: v137.67,47.62 136.02,47.62 129.16,54.48 v115.95,54.48 | v103.63,54.74 99.82,50.93 v97.16,50.93 | v90.68,50.04 v90.68,45.47
G1  (via drill 0.35)
  Top 0.152: R16.1 120.69,93.81 121.28,93.22 v128.27,93.22
  Top 0.254: Q2.8 118.24,95.27 119,94.51 120.33,94.51 120.34,94.49 R16.1 | R9.1 v136.02,72.14
  Bottom 0.152: v136.02,72.14 136.02,72.01 135.64,71.63 133.48,71.63 129.51,75.59 129.51,84.56 128.27,85.8 v128.27,93.22
G2  (via drill 0.35)
  Top 0.152: R15.1 120.69,97.32 121.03,97.66 123.83,97.66 124.71,96.77 v128.91,96.77
  Top 0.254: Q2.6 119.62,96.66 119.76,96.52 R15.1 | R10.1 v134.24,72.26
  Bottom 0.152: v128.91,96.77 129.03,96.65 129.03,85.72 129.92,84.84 129.92,75.69 133.35,72.26 v134.24,72.26
GND  (via drill 0.35)
  Top 0.254: C5.2 72.69,91.78 72.9,91.57 | C6.2 78.14,92.08 79.5,92.08 79.88,92.46 79.88,96.63 79.74,96.77 | 131.44,91.44 C17.1 134.41,92.92 134.11,93.22 134.11,95.89 134.24,96.01 U4.4 | 131.44,91.44 131.19,91.44 130.59,90.84 R35.2 | U5.4 134.63,86.37 133.35,85.09 131.44,85.09 130.59,85.94 R46.1 | U3.4 116.2,86.87 116.37,86.7 R17.2 115.44,85.34 v114.94,85.85 | C10.2 114.08,93.43 v114.17,93.34 | C13.2 117.82,73.24 119.17,74.59 U2.4 | R48.1 130.59,93.31 131.44,92.46 131.44,91.44
  Top 0.508: 95.63,4.32 136.02,4.32 PTH6.1 136.78,10.79 137.29,11.3 CON6.11 122.56,14.22 120.38,16.39 | 32.38,1.27 33.02,1.91 33.02,4.95 34.71,6.65 PTH3.1 38.85,18.41 v40.77,18.41 | 32.38,1.27 10.67,1.27 6.86,5.08 PTH5.1 | LED3.C 120.38,16.39 | 120.38,16.39 117.97,16.39 117.47,16.89 117.47,20.07 117.86,20.45 120.14,20.45 120.38,20.69 LED2.C 130.68,21.34 135,25.65 141.1,25.65 141.73,26.29 141.73,27.94 140.59,29.08 139.19,29.08 CON7.11 | v53.34,93.98 53.34,96.52 52.45,97.41 v52.45,98.42 | v16.13,53.85 23.88,53.85 25.53,55.5 v25.53,58.8 v25.53,61.21 | 32.38,1.27 94.49,1.27 95.63,2.41 95.63,4.32 | CON1.P$9 arc90 72.9,33.2 v72.9,30.61 | v25.91,88.01 25.91,80.39 v26.04,80.26 | v31.37,74.3 31.62,74.04 31.62,71.37 30.35,70.1 29.72,70.1 v29.46,69.85 | CON1.P$1 73.08,73.03 v74.04,73.03 | C3.2 64.05,50.46 66.29,52.7 72.9,52.7 | C4.2 v83.44,45.34 | v73.91,46.86 72.9,46.86 | v97.41,26.67 v97.41,20.07 | 95.63,4.32 95.12,4.32 93.34,6.1 85.34,6.1 79.8,11.64 PTH4.1 79.63,14.45 79.63,18.67 80.14,19.18 v84.71,19.18 | C10.2 C11.2 114.08,101 115.95,102.87 R30.1 | R35.2 R46.1 126.11,87.38 | R18.2 126.11,87.38 | R36.2 R37.1 R34.2 R47.1 140.17,103.29 PTH8.1 134.66,104.56 C16.1 134.57,99.66 130.59,99.66 | R31.1 127.38,102.87 130.59,99.66 | 130.59,99.66 R33.2 R48.1 | C14.2 122.77,91.82 125.09,91.82 126.11,90.81 126.11,87.38 | R17.2 116.37,84.42 117.09,83.69 v123.7,83.69 125.35,83.69 126.11,84.45 126.11,87.38 | v123.57,80.14 123.91,79.8 R24.2 C15.2 123.91,72.1 122.68,70.87 C13.2 | U13.20 126.11,49.4 127.13,50.42 127.13,58.04 117.82,67.35 C13.2 | U13.12 v111.51,40.51 | v117.86,64.39 117.82,64.43 C13.2
  Top 0.635: CON1.P$9 CON1.P$10 CON1.P$11 72.9,46.86 CON1.P$12 72.9,52.7 CON1.P$5 CON1.P$6 CON1.P$7 CON1.P$8 CON1.P$1 CON1.P$2 CON1.P$3 CON1.P$4 72.9,91.57 72.9,94.75 74.93,96.77 79.74,96.77 PTH1.1 73.88,102.74 v68.71,102.74 56.77,102.74 v52.45,98.42 | CON1.P$9 76.27,33.2 77.3,32.17 C2.2 | C1.2 69.89,32.17 70.92,33.2 CON1.P$9 | PTH7.1 8.38,109.98 34.16,109.98 35.4,108.75 35.4,103.22 34.71,102.54 PTH2.1 38.91,96.95 40.39,98.42 v47.12,98.42
  Bottom 0.254: v114.94,85.85 114.94,92.58 v114.17,93.34
  Bottom 0.508: PTH1.1 93.78,96.83 103.5,106.55 136.27,106.55 136.65,106.17 136.78,106.3 PTH8.1 | U9.12 13.34,10.16 8.26,5.08 PTH5.1 | U1.12 v53.34,93.98 | U8.12 15.88,52.7 16.13,52.96 v16.13,53.85 | U7.12 v25.53,58.8 | U6.12 v25.91,88.01 31.37,88.01 34.71,91.36 PTH2.1 | U10.12 51.44,12.7 50.29,13.84 47.62,13.84 43.05,18.41 v40.77,18.41 | v72.9,30.61 72.9,21.18 PTH4.1 | v26.04,80.26 31.37,74.93 v31.37,74.3 | v29.46,69.85 29.46,68.83 29.87,68.43 29.87,64.16 26.92,61.21 v25.53,61.21 | U11.12 86.11,77.6 80.54,72.03 75.69,72.03 74.7,73.03 v74.04,73.03 | v83.44,45.34 83.44,46.1 82.68,46.86 v73.91,46.86 | v97.41,20.07 96.52,19.18 v84.71,19.18 | U12.12 v97.41,26.67 | v123.7,83.69 123.57,83.57 v123.57,80.14 | v111.51,40.51 110.54,41.48 110.54,57.33 113.92,60.71 v114.17,60.71 v117.86,64.39
  Bottom 0.635: v52.45,98.42 v47.12,98.42
  pour Top: -0.13,111.76 143.13,111.76 143.13,0 0,0 0,111.63
  pour Bottom: 0,111.76 143.13,111.76 143.13,0 0,0
IO0  (via drill 0.35)
  Top 0.152: CON1.6 77.93,87.9 78.11,88.07 v78.11,88.14
  Bottom 0.152: v78.11,88.14 57.91,88.14 57.15,88.9 U1.9 57.15,93.73 59.18,95.76 68.33,95.76 75.82,103.25 75.82,108.33 77.22,109.73 91.44,109.73 92.58,108.58 CON2.1
IO1
  Top 0.152: CON1.5 55.96,87.9 51.79,92.07 51.79,103.43 52.17,103.81 86.41,103.81 CON2.2
  Bottom 0.152: U1.8 58.42,93.73 60.07,95.38 68.58,95.38 76.22,103.02 76.22,108.23 77.34,109.35 88.14,109.35 CON2.2
IO2  (via drill 0.35)
  Top 0.152: CON1.8 78.38,87.4 v79.12,88.14 79.12,89.15 80.14,90.17 80.77,90.17 94.11,103.5 94.11,108.2 93.6,108.71 88.77,108.71 CON2.3
  Bottom 0.152: v79.12,88.14 78.49,88.77 59.82,88.77 59.56,89.03 59.56,92.2 U1.7
IO3
  Top 0.152: CON1.7 68.66,87.4 68.54,87.53 55.9,87.53 51.49,91.94 51.49,103.56 52.05,104.11 81.89,104.11 84.96,107.19 CON2.4
  Bottom 0.152: U1.6 60.96,93.85 62.1,95 68.83,95 78.61,104.78 78.61,108.33 79.12,108.84 83.57,108.84 CON2.4
IO4  (via drill 0.35)
  Top 0.152: CON1.10 78.9,86.9 v80.14,88.14 80.14,89.28 80.72,89.86 80.9,89.86 94.41,103.38 94.41,108.33 93.65,109.09 84.07,109.09 CON2.5
  Bottom 0.152: v80.14,88.14 79.12,89.15 62.48,89.15 62.23,89.41 U1.5
IO5
  Top 0.152: CON1.9 68.66,86.9 68.41,87.15 55.84,87.15 51.18,91.82 51.18,103.74 51.87,104.42 76.86,104.42 CON2.6
  Bottom 0.152: U1.4 63.5,93.6 64.52,94.61 69.09,94.61 79.88,105.41 CON2.6
IO6  (via drill 0.35)
  Top 0.152: CON1.12 79.42,86.4 v81.15,88.14 81.15,89.69 94.74,103.28 94.74,108.51 93.78,109.47 79.38,109.47 CON2.7
  Bottom 0.152: v81.15,88.14 79.83,89.46 65.1,89.46 64.77,89.79 U1.3
IO7  (via drill 0.35)
  Top 0.152: CON1.11 68.66,86.4 68.28,86.78 55.79,86.78 50.88,91.69 50.88,103.86 51.74,104.72 72.08,104.72 CON2.8 | v71.75,96.27 v71.75,100.08
  Bottom 0.152: U1.2 66.04,93.47 66.8,94.23 69.72,94.23 v71.75,96.27 | CON2.8 74.8,103.12 v71.75,100.08
IO8  (via drill 0.35)
  Top 0.152: CON1.14 80.31,85.9 v81.79,87.38
  Bottom 0.152: CON2.9 72.26,107.19 70.31,105.23 67.77,105.23 66.04,103.5 U1.23 66.04,97.66 64.44,96.06 54.03,96.06 52.2,94.23 52.2,90.81 55.63,87.38 v81.79,87.38
IO9
  Top 0.152: CON1.13 68.66,85.9 68.16,86.41 55.73,86.41 50.57,91.56 50.57,103.99 51.61,105.03 67.82,105.03 69.72,106.93 CON2.10
  Bottom 0.152: U1.22 64.77,103.63 67.06,105.92 68.2,105.92 CON2.10
IO10  (via drill 0.35)
  Top 0.152: CON1.16 81.21,85.4 v82.42,86.61
  Bottom 0.152: CON2.11 63.5,103.76 U1.21 63.75,101.47 63.75,101.22 63.5,100.97 63.5,97.79 62.08,96.37 53.9,96.37 51.89,94.36 51.89,90.68 55.96,86.61 v82.42,86.61
IO11
  Top 0.152: CON1.15 68.66,85.4 68.03,86.03 55.67,86.03 50.27,91.44 50.27,104.11 51.51,105.36 62.56,105.36 CON2.12
  Bottom 0.152: U1.20 62.23,105.03 CON2.12
IO12  (via drill 0.35)
  Top 0.152: CON1.18 81.72,84.9 v82.42,85.6
  Bottom 0.152: CON2.13 60.96,106.3 U1.19 60.96,97.41 60.22,96.67 53.77,96.67 51.59,94.49 51.59,90.55 54.23,87.91 54.23,87.88 54.26,87.88 55.83,86.31 81.71,86.31 v82.42,85.6
IO13
  Top 0.152: CON1.17 68.66,84.9 67.9,85.66 55.61,85.66 49.96,91.31 49.96,104.27 51.46,105.77 57.89,105.77 CON2.14
  Bottom 0.152: U1.18 59.69,107.31 CON2.14
IO14  (via drill 0.35)
  Top 0.152: v82.42,84.58 82.24,84.4 CON1.20
  Bottom 0.152: CON2.15 57.02,106.43 58.42,105.03 U1.17 58.42,98.17 57.23,96.98 53.65,96.98 51.28,94.61 51.28,90.4 55.68,86 81,86 v82.42,84.58
IO15
  Top 0.152: CON1.19 68.66,84.4 67.78,85.29 55.55,85.29 49.66,91.19 49.66,104.39 51.56,106.3 53.34,106.3 CON2.16
  Bottom 0.152: U1.16 57.15,103.76 54.48,106.43 CON2.16
IO16  (via drill 0.35)
  Top 0.152: v83.19,83.95 83.14,83.9 CON1.22
  Bottom 0.152: U6.9 25.78,91.82 28.17,94.21 28.17,99.9 31.8,103.53 34.24,103.53 34.85,104.14 48.64,104.14 CON2.17 48.9,104.39 45.52,104.39 45.52,95.73 55.55,85.7 80.29,85.7 82.04,83.95 v83.19,83.95
IO17
  Top 0.152: CON1.21 68.66,83.9 67.65,84.92 55.42,84.92 49.28,91.06 49.28,107.31 CON2.18
  Bottom 0.152: U6.8 25.65,93.09 27.86,95.3 27.86,100.03 31.67,103.83 34.11,103.83 34.72,104.44 42.19,104.44 43.15,105.41 47.37,105.41 CON2.18
IO18  (via drill 0.35)
  Top 0.152: CON1.24 82.72,83.4 v83.19,82.93
  Bottom 0.152: CON2.19 46.86,107.06 45.59,105.79 43.1,105.79 42.06,104.75 34.59,104.75 33.99,104.14 31.54,104.14 27.56,100.16 27.56,96.65 25.27,94.36 U6.7 20.45,94.36 20.19,94.11 20.19,87 23.75,83.44 82.55,83.44 83.06,82.93 v83.19,82.93
IO19
  Top 0.152: CON1.23 68.66,83.4 67.52,84.54 55.28,84.54 48.9,90.93 48.9,104.52 47.24,106.17 45.59,106.17 CON2.20
  Bottom 0.152: U6.6 25.02,95.63 27.18,97.79 27.18,100.33 31.29,104.44 33.86,104.44 34.47,105.05 41.93,105.05 CON2.20
IO20  (via drill 0.35)
  Top 0.152: CON1.26 81.82,82.9 v82.17,82.55
  Bottom 0.152: CON2.21 39.7,105.36 34.34,105.36 33.73,104.75 31.16,104.75 26.82,100.41 26.82,98.58 25.15,96.9 U6.5 21.72,96.9 19.81,95 19.81,86.87 23.62,83.06 81.66,83.06 v82.17,82.55
IO21
  Top 0.152: CON2.22 40.89,105.79 47.12,105.79 48.51,104.39 48.51,90.81 55.14,84.18 67.39,84.18 68.66,82.9 CON1.25
  Bottom 0.152: U6.4 24.89,98.17 26.52,99.8 26.52,100.53 31.04,105.05 33.61,105.05 34.22,105.66 37.72,105.66 39.24,107.19 CON2.22
IO22  (via drill 0.35)
  Top 0.152: CON1.28 81.43,82.4 81.92,81.92 v83.19,81.92
  Bottom 0.152: CON2.23 35.31,106.05 34.17,106.05 33.48,105.36 30.81,105.36 24.89,99.44 U6.3 22.1,99.44 21.72,99.06 21.72,97.54 19.43,95.25 19.43,86.74 23.5,82.68 80.77,82.68 81.53,81.92 v83.19,81.92
IO23
  Top 0.152: CON2.24 29.46,102.74 29.46,85.72 31.39,83.8 67.27,83.8 68.66,82.4 CON1.27
  Bottom 0.152: U6.2 25.7,100.71 30.66,105.66 32.38,105.66 CON2.24
IO24  (via drill 0.35)
  Top 0.152: CON1.30 81.04,81.9 81.66,81.28 v82.17,81.28
  Bottom 0.152: CON2.25 30.61,106.43 28.57,106.43 26.62,104.47 12.45,104.47 12.03,104.05 12.03,101 12.32,100.71 U6.23 15.37,100.71 16,100.08 16,93.6 18.09,91.52 18.09,87.58 23.37,82.3 80.26,82.3 81.28,81.28 v82.17,81.28
IO25
  Top 0.152: CON2.26 29.08,85.6 31.27,83.42 67.15,83.42 68.66,81.9 CON1.29
  Bottom 0.152: U6.22 12.19,99.44 11.68,99.95 11.68,104.14 12.32,104.78 26.42,104.78 CON2.26
IO26  (via drill 0.35)
  Top 0.152: CON1.32 80.78,81.4 81.53,80.64 v83.19,80.64
  Bottom 0.152: CON2.27 24.21,105.11 12.22,105.11 11.38,104.27 11.38,98.68 11.89,98.17 U6.21 15.24,98.17 15.62,97.79 15.62,93.47 17.78,91.31 17.78,87.38 23.24,81.92 80.01,81.92 81.28,80.64 v83.19,80.64
IO27
  Top 0.152: CON2.28 25.84,105.6 27.75,105.6 28.7,104.65 28.7,85.55 31.2,83.05 67.01,83.05 68.66,81.4 CON1.31
  Bottom 0.152: CON2.28 21.97,105.41 12.06,105.41 11.07,104.42 11.07,97.41 11.58,96.9 U6.20
IO28  (via drill 0.35)
  Top 0.152: CON1.34 80.64,80.9 81.53,80.01 v82.17,80.01
  Bottom 0.152: CON2.29 21.46,107.18 20.02,105.74 11.89,105.74 10.77,104.62 10.77,96.14 11.28,95.63 U6.19 15.24,95.63 15.24,93.22 17.4,91.06 17.4,87.25 23.11,81.53 79.76,81.53 81.28,80.01 v82.17,80.01
IO29
  Top 0.152: CON2.30 21.08,105.28 27.64,105.28 28.32,104.6 28.32,85.47 31.11,82.68 66.89,82.68 68.66,80.9 CON1.33
  Bottom 0.152: CON2.30 17.53,106.05 11.73,106.05 10.46,104.78 10.46,94.87 10.97,94.36 U6.18
IO30  (via drill 0.35)
  Top 0.152: CON1.36 80.51,80.4 81.53,79.38 83.57,79.38 v84.07,79.88
  Bottom 0.152: CON2.31 15.37,106.43 11.68,106.43 10.16,104.9 10.16,93.85 10.92,93.09 U6.17 14.86,93.09 17.02,90.93 17.02,87.12 22.99,81.15 79.5,81.15 81.28,79.38 83.57,79.38 v84.07,79.88
IO31
  Top 0.152: CON2.32 16.26,105.03 20.91,105.03 20.96,104.98 27.36,104.98 27.94,104.39 27.94,85.34 30.97,82.31 66.75,82.31 68.66,80.4 CON1.35
  Bottom 0.152: U6.16 11.05,91.82 9.86,93.02 9.86,105.11 12.19,107.44 CON2.32
IO32  (via drill 0.35)
  Top 0.152: CON1.38 79.61,79.9 81.03,78.49 83.06,78.49 v84.07,77.47
  Bottom 0.152: CON3.1 3.56,95.63 6.63,92.56 6.63,80.62 7.26,79.98 21.2,79.98 27.48,73.71 27.48,73.66 | 27.48,73.66 27.48,65.2 24.89,62.61 U7.9 | v84.07,77.47 83.06,78.49 80.64,78.49 79.63,77.47 57.53,77.47 53.72,73.66 27.48,73.66
IO33
  Top 0.152: CON1.37 68.03,79.9 67.65,79.52 15.73,79.52 5.84,89.41 5.84,91.19 3.94,93.09 CON3.2
  Bottom 0.152: U7.8 24.89,63.88 27.18,66.17 27.18,73.58 21.08,79.68 7.13,79.68 6.33,80.49 6.33,90.32 3.56,93.09 CON3.2
IO34  (via drill 0.35)
  Top 0.152: v28.83,65.15 v24.89,65.15 | CON1.40 79.35,79.4 80.64,78.11 82.42,78.11 v83.06,77.47
  Bottom 0.152: CON3.3 3.17,90.55 6.02,87.71 6.02,80.36 7.01,79.38 20.95,79.38 26.87,73.45 26.87,67.13 v24.89,65.15 U7.7 | v28.83,65.15 28.07,65.91 28.07,72.39 29.03,73.36 53.85,73.36 57.58,77.09 79.76,77.09 80.77,78.11 82.42,78.11 v83.06,77.47
IO35
  Top 0.152: CON1.39 68.03,79.4 67.78,79.15 15.6,79.15 6.73,88.01 CON3.4
  Bottom 0.152: CON3.4 3.56,88.01 5.71,85.85 5.71,80.24 6.88,79.07 20.82,79.07 26.57,73.33 26.57,68.1 24.89,66.42 U7.6
IO36  (via drill 0.35)
  Top 0.152: v28.83,67.94 v25.27,67.94 | CON1.42 79.09,78.9 80.52,77.47 v81.41,77.47
  Bottom 0.152: U7.5 25.02,67.69 v25.27,67.94 26.21,68.89 26.21,73.25 20.7,78.77 6.76,78.77 5.33,80.19 5.33,84.45 4.32,85.47 CON3.5 | v28.83,67.94 28.57,68.2 28.57,72.47 29.16,73.05 54,73.05 57.66,76.71 79.88,76.71 80.64,77.47 v81.41,77.47
IO37
  Top 0.152: CON3.6 11.33,82.93 15.49,78.77 67.9,78.77 68.03,78.9 CON1.41
  Bottom 0.152: CON3.6 3.94,82.93 4.95,81.92 4.95,80.14 6.63,78.46 20.57,78.46 25.91,73.12 25.91,69.98 24.89,68.96 U7.4
IO38  (via drill 0.35)
  Top 0.152: v29.34,70.99 25.78,70.99 v24.89,70.1 | CON1.44 78.83,78.4 80.39,76.83 v82.17,76.83
  Bottom 0.152: U7.3 23.37,70.1 v24.89,70.1 25.53,70.74 25.53,73.08 20.45,78.16 6.43,78.16 4.19,80.39 CON3.7 | v29.34,70.99 29.34,72.39 29.69,72.75 54.13,72.75 57.71,76.33 80.14,76.33 80.64,76.83 v82.17,76.83
IO39
  Top 0.152: CON1.43 9.44,78.4 6.86,75.82 4.19,75.82 CON3.8
  Bottom 0.152: CON3.8 20.32,77.85 25.15,73.03 25.15,71.75 24.89,71.5 U7.2
IO40  (via drill 0.35)
  Top 0.152: CON1.46 78.3,77.91 80.01,76.2 v81.41,76.2
  Bottom 0.152: CON3.9 5.97,75.31 9.78,71.5 U7.23 16.13,71.5 17.91,69.72 17.91,61.09 21.21,57.78 29.34,57.78 31.11,59.56 31.11,70.74 32.82,72.44 54.25,72.44 57.76,75.95 80.26,75.95 80.52,76.2 v81.41,76.2
IO41
  Top 0.152: CON3.10 4.32,72.77 9.57,78.03 67.9,78.03 68.03,77.9 CON1.45
  Bottom 0.152: CON3.10 6.99,72.77 9.53,70.23 U7.22
IO42  (via drill 0.35)
  Top 0.152: CON1.48 77.92,77.4 79.76,75.56 v82.17,75.56
  Bottom 0.152: CON3.11 7.37,70.23 8.64,68.96 U7.21 16.13,68.96 17.6,67.49 17.6,60.96 21.08,57.48 29.46,57.48 31.42,59.44 31.42,70.61 32.94,72.14 54.38,72.14 57.81,75.56 v82.17,75.56
IO43
  Top 0.152: CON1.47 68.03,77.4 67.78,77.65 9.71,77.65 5.89,73.84 5.89,69.27 4.32,67.69 CON3.12
  Bottom 0.152: CON3.12 U7.20
IO44  (via drill 0.35)
  Top 0.152: CON1.50 77.66,76.9 79.63,74.93 v81.41,74.93
  Bottom 0.152: CON3.13 7.37,65.15 8.64,66.42 U7.19 16.13,66.42 17.3,65.25 17.3,60.83 20.96,57.17 29.59,57.17 31.73,59.31 31.73,70.49 33.07,71.83 54.51,71.83 57.93,75.26 81.08,75.26 v81.41,74.93
IO45
  Top 0.152: CON3.14 4.57,62.61 6.22,64.26 6.22,73.66 9.88,77.32 67.61,77.32 68.03,76.9 CON1.49
  Bottom 0.152: CON3.14 6.86,62.61 9.4,65.15 U7.18
IO46  (via drill 0.35)
  Top 0.152: CON1.52 77.4,76.4 79.5,74.3 80.77,74.3 v81.15,73.91
  Bottom 0.152: CON3.15 6.1,60.07 9.91,63.88 U7.17 16,63.88 16.99,62.89 16.99,60.71 20.83,56.87 29.72,56.87 32.03,59.18 32.03,62.48 32.03,70.36 33.2,71.53 54.63,71.53 58.06,74.95 80.11,74.95 v81.15,73.91
IO47
  Top 0.152: CON1.51 68.03,76.4 67.52,76.91 9.98,76.91 6.6,73.53 6.6,59.18 4.95,57.53 CON3.16
  Bottom 0.152: CON3.16 5.46,57.53 10.54,62.61 U7.16
IO48  (via drill 0.35)
  Top 0.152: CON1.54 77.39,75.9 79.63,73.66 80.26,73.66 80.39,73.53 v80.39,73.03
  Bottom 0.152: CON3.17 4.19,54.99 10.29,48.9 U8.9 16.13,48.9 17.91,50.67 17.91,53.34 20.83,56.26 30.86,56.26 33.91,59.31 33.91,69.6 35.53,71.22 54.76,71.22 58.19,74.65 79.65,74.65 80.39,73.91 v80.39,73.03
IO49
  Top 0.152: CON1.53 68.03,75.9 67.39,76.53 10.11,76.53 6.99,73.41 6.99,54.86 4.57,52.45 CON3.18
  Bottom 0.152: CON3.18 5.46,52.45 10.29,47.62 U8.8
IO50  (via drill 0.35)
  Top 0.152: CON1.56 77.25,75.4 79.38,73.28 v79.38,73.03
  Bottom 0.152: CON3.19 6.86,49.91 10.41,46.35 U8.7 15.88,46.35 18.21,48.69 18.21,53.21 20.95,55.96 30.99,55.96 34.21,59.18 34.21,69.47 35.66,70.92 54.88,70.92 58.31,74.35 78.94,74.35 79.38,73.91 v79.38,73.03
IO51
  Top 0.152: CON3.20 4.83,47.37 7.37,49.91 7.37,73.28 10.25,76.16 67.27,76.16 68.03,75.4 CON1.55
  Bottom 0.152: U8.6 10.41,45.09 8.13,47.37 CON3.20
IO52  (via drill 0.35)
  Top 0.152: CON1.58 76.99,74.9 78.36,73.53 v78.36,73.03
  Bottom 0.152: CON3.21 9.14,44.83 10.16,43.81 U8.5 16.26,43.81 18.52,46.08 18.52,53.09 21.08,55.65 31.11,55.65 34.52,59.06 34.52,69.32 35.81,70.61 55.01,70.61 58.44,74.04 78.23,74.04 78.36,73.91 v78.36,73.03
IO53
  Top 0.152: CON1.57 68.03,74.9 67.14,75.79 10.38,75.79 7.67,73.08 7.67,45.26 4.7,42.29 CON3.22
  Bottom 0.152: U8.4 9.91,42.55 9.65,42.29 CON3.22
IO54  (via drill 0.35)
  Top 0.152: CON1.60 76.01,74.3 76.96,74.3 77.34,73.91 v77.34,73.03
  Bottom 0.152: CON3.23 8.38,39.75 9.91,41.27 U8.3 16.89,41.27 18.82,43.2 18.82,52.96 21.21,55.35 31.24,55.35 34.82,58.93 34.82,69.19 35.94,70.31 55.14,70.31 58.57,73.74 76.63,73.74 v77.34,73.03
IO55
  Top 0.152: CON3.24 4.7,37.21 7.98,40.49 7.98,72.79 10.59,75.41 67.02,75.41 68.03,74.4 CON1.59
  Bottom 0.152: CON3.24 7.11,37.21 9.91,40.01 U8.2
IO56  (via drill 0.35)
  Top 0.152: CON1.62 76.9,68.9 77.85,69.85 v77.85,70.48
  Bottom 0.152: CON3.25 23.24,34.67 26.04,37.47 26.04,39.24 25.27,40.01 U8.23 21.97,40.01 21.08,40.89 21.08,45.97 19.13,47.93 19.13,52.78 21.34,54.99 31.37,54.99 35.18,58.8 35.18,68.83 36.32,69.98 77.34,69.98 v77.85,70.48
IO57
  Top 0.152: CON1.61 68.92,68.9 66.5,66.49 15.05,66.49 12.85,64.29 12.85,32.79 12.19,32.13 CON3.26
  Bottom 0.152: CON3.26 2.41,32.38 21.46,32.38 26.34,37.26 26.34,40.21 25.27,41.27 U8.22
IO58  (via drill 0.35)
  Top 0.152: CON1.64 77.16,68.4 v78.87,70.1